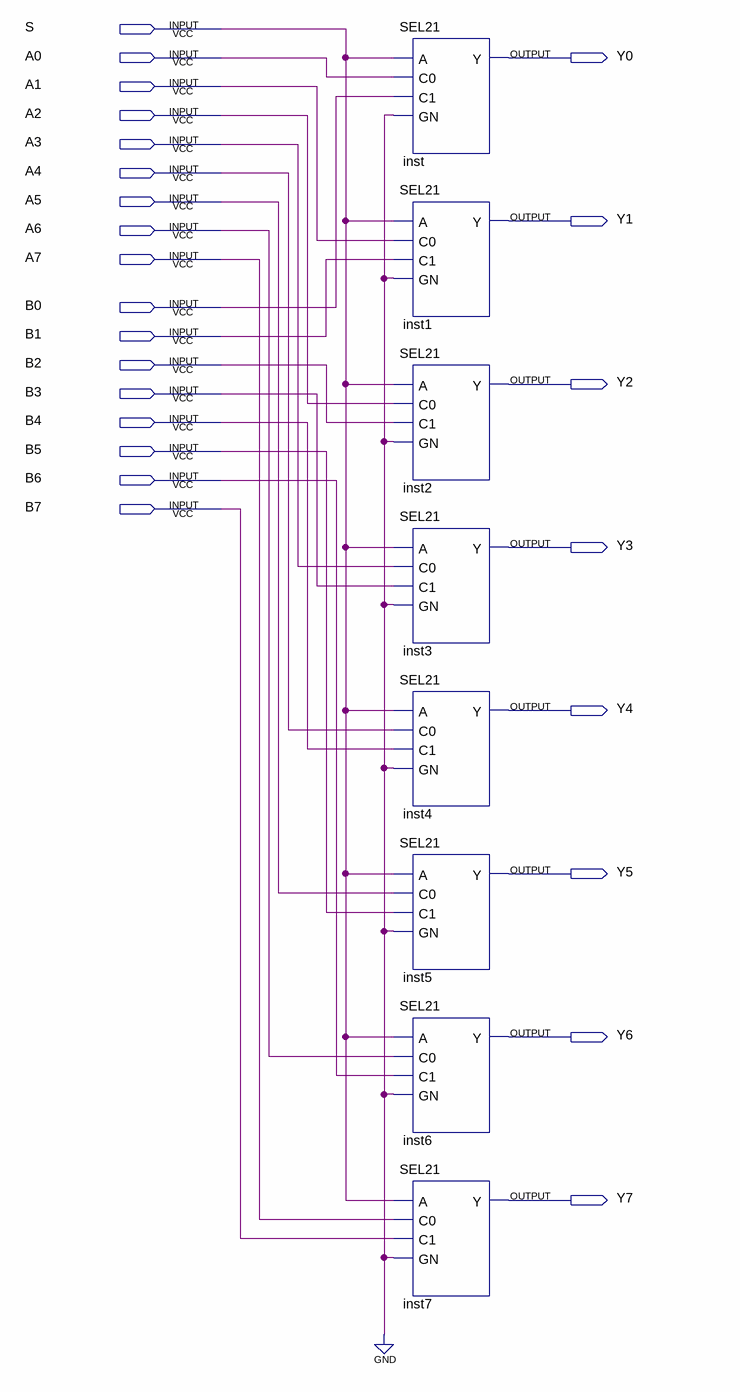
[diagram p0: schematic sheet]
// Quartus schematic SEL218.bdf as structural Verilog: 8 symbols, 25 pins
module SEL218 (
  input  S,
  input  A0,
  input  A1,
  input  A2,
  input  A3,
  input  A4,
  input  A5,
  input  A6,
  input  A7,
  input  B0,
  input  B1,
  input  B2,
  input  B3,
  input  B4,
  input  B5,
  input  B6,
  input  B7,
  output Y0,
  output Y1,
  output Y2,
  output Y3,
  output Y4,
  output Y5,
  output Y6,
  output Y7
);

  SEL21 inst (.A(S), .C0(A0), .C1(B0), .GN(1'b0), .Y(Y0));
  SEL21 inst1 (.A(S), .C0(A1), .C1(B1), .GN(1'b0), .Y(Y1));
  SEL21 inst2 (.A(S), .C0(A2), .C1(B2), .GN(1'b0), .Y(Y2));
  SEL21 inst3 (.A(S), .C0(A3), .C1(B3), .GN(1'b0), .Y(Y3));
  SEL21 inst4 (.A(S), .C0(A4), .C1(B4), .GN(1'b0), .Y(Y4));
  SEL21 inst5 (.A(S), .C0(A5), .C1(B5), .GN(1'b0), .Y(Y5));
  SEL21 inst6 (.A(S), .C0(A6), .C1(B6), .GN(1'b0), .Y(Y6));
  SEL21 inst7 (.A(S), .C0(A7), .C1(B7), .GN(1'b0), .Y(Y7));
endmodule
